# Altium schematic sheet Sheet2.SchDoc
size A4; SheetNumber: 2; SheetTotal: 2
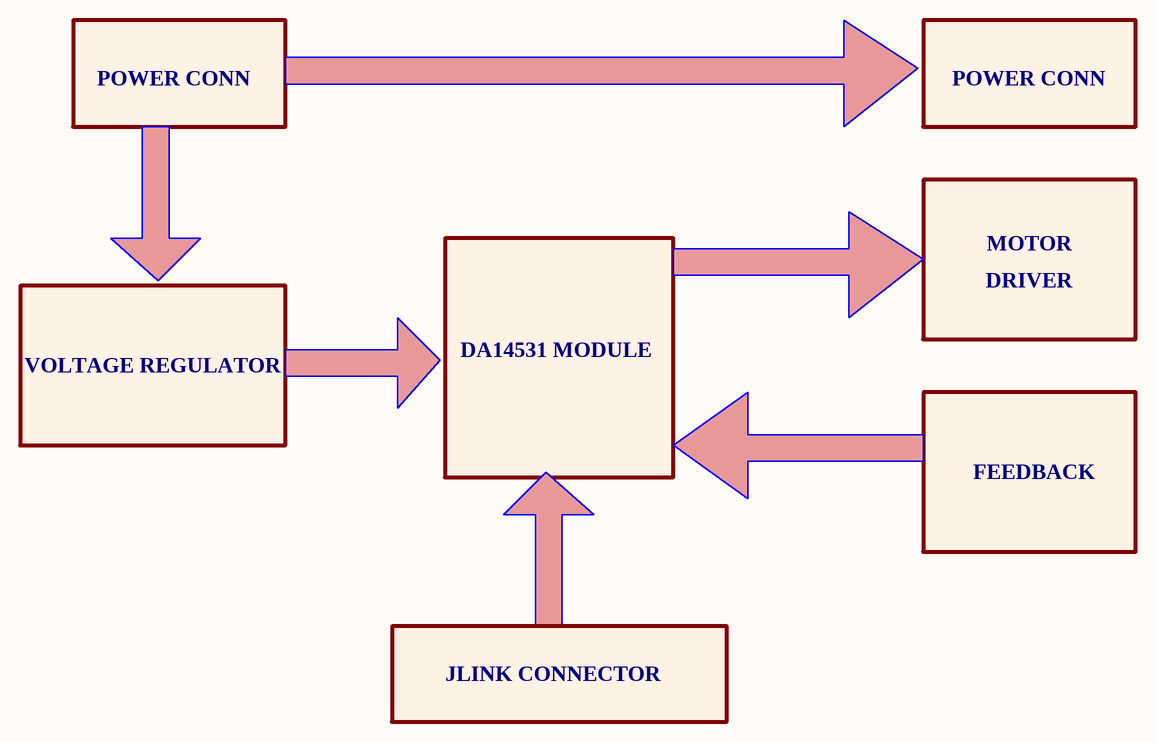
[diagram p0: Sheet2.SchDoc]

## Notes on the sheet
- POWER CONN
- MOTOR
- DRIVER
- VOLTAGE REGULATOR
- DA14531 MODULE
- FEEDBACK
- JLINK CONNECTOR